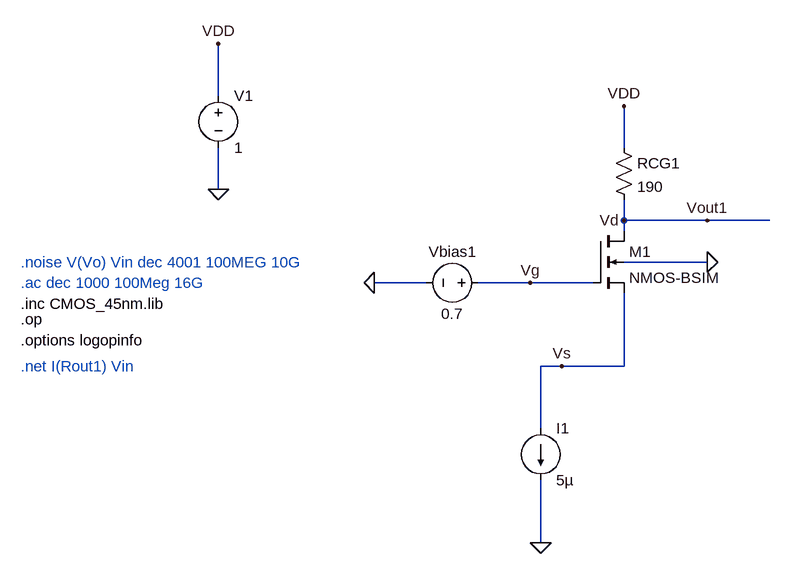
[diagram p0: schematic teste_45nm_N1.asc]
teste_45nm_N1.asc, the LTspice schematic file:
Version 4.1
SHEET 1 880 680
WIRE -656 -384 -656 -464
WIRE -32 -304 -32 -368
WIRE -656 -240 -656 -304
WIRE -32 -192 -32 -224
WIRE 96 -192 -32 -192
WIRE 192 -192 96 -192
WIRE -32 -176 -32 -192
WIRE 96 -128 -32 -128
WIRE -336 -96 -416 -96
WIRE -176 -96 -256 -96
WIRE -80 -96 -176 -96
WIRE -128 32 -160 32
WIRE -32 32 -32 -80
WIRE -32 32 -128 32
WIRE -160 128 -160 32
WIRE -160 304 -160 208
FLAG -416 -96 0
FLAG -32 -368 VDD
FLAG 96 -128 0
FLAG 96 -192 Vout1
FLAG -656 -240 0
FLAG -656 -464 VDD
FLAG -128 32 Vs
FLAG -32 -192 Vd
FLAG -176 -96 Vg
FLAG -160 304 0
SYMBOL voltage -240 -96 R90
WINDOW 0 -32 56 VBottom 2
WINDOW 3 32 56 VTop 2
WINDOW 123 0 0 Left 0
WINDOW 39 0 0 Left 0
SYMATTR InstName Vbias1
SYMATTR Value 0.7
SYMBOL res -48 -320 R0
SYMATTR InstName RCG1
SYMATTR Value 190
SYMBOL nmos4 -80 -176 R0
SYMATTR InstName M1
SYMATTR Value NMOS-BSIM
SYMATTR Value2 l=15u w=45u
SYMBOL voltage -656 -400 R0
WINDOW 123 0 0 Left 0
WINDOW 39 0 0 Left 0
SYMATTR InstName V1
SYMATTR Value 1
SYMBOL current -160 128 R0
WINDOW 123 0 0 Left 0
WINDOW 39 0 0 Left 0
SYMATTR InstName I1
SYMATTR Value 5µ
TEXT -960 -40 Left 2 !.op
TEXT -960 -8 Left 2 !.options logopinfo
TEXT -960 -64 Left 2 !.inc CMOS_45nm.lib
TEXT -960 -96 Left 2 ;.ac dec 1000 100Meg 16G
TEXT -960 -128 Left 2 ;.noise V(Vo) Vin dec 4001 100MEG 10G
TEXT -960 32 Left 2 ;.net I(Rout1) Vin

The netlist it stands for:
* teste_45nm_N1.asc
Vbias1 Vg 0 0.7
RCG1 VDD Vd 190
M1 Vd Vg Vs 0 NMOS-BSIM l=15u w=45u
V1 VDD 0 1
I1 Vs 0 5µ
.model NMOS NMOS
.model PMOS PMOS
.lib standard.mos
.op
.options logopinfo
.inc CMOS_45nm.lib
* .ac dec 1000 100Meg 16G
* .noise V(Vo) Vin dec 4001 100MEG 10G
* .net I(Rout1) Vin
.backanno
.end